# Altium schematic sheet updatedLoraXbee.SchDoc: Micro_controller_LoRa
size A4; Organization: Controlytics.ai; Address4: Micro_controller; SheetNumber: 2; SheetTotal: 2
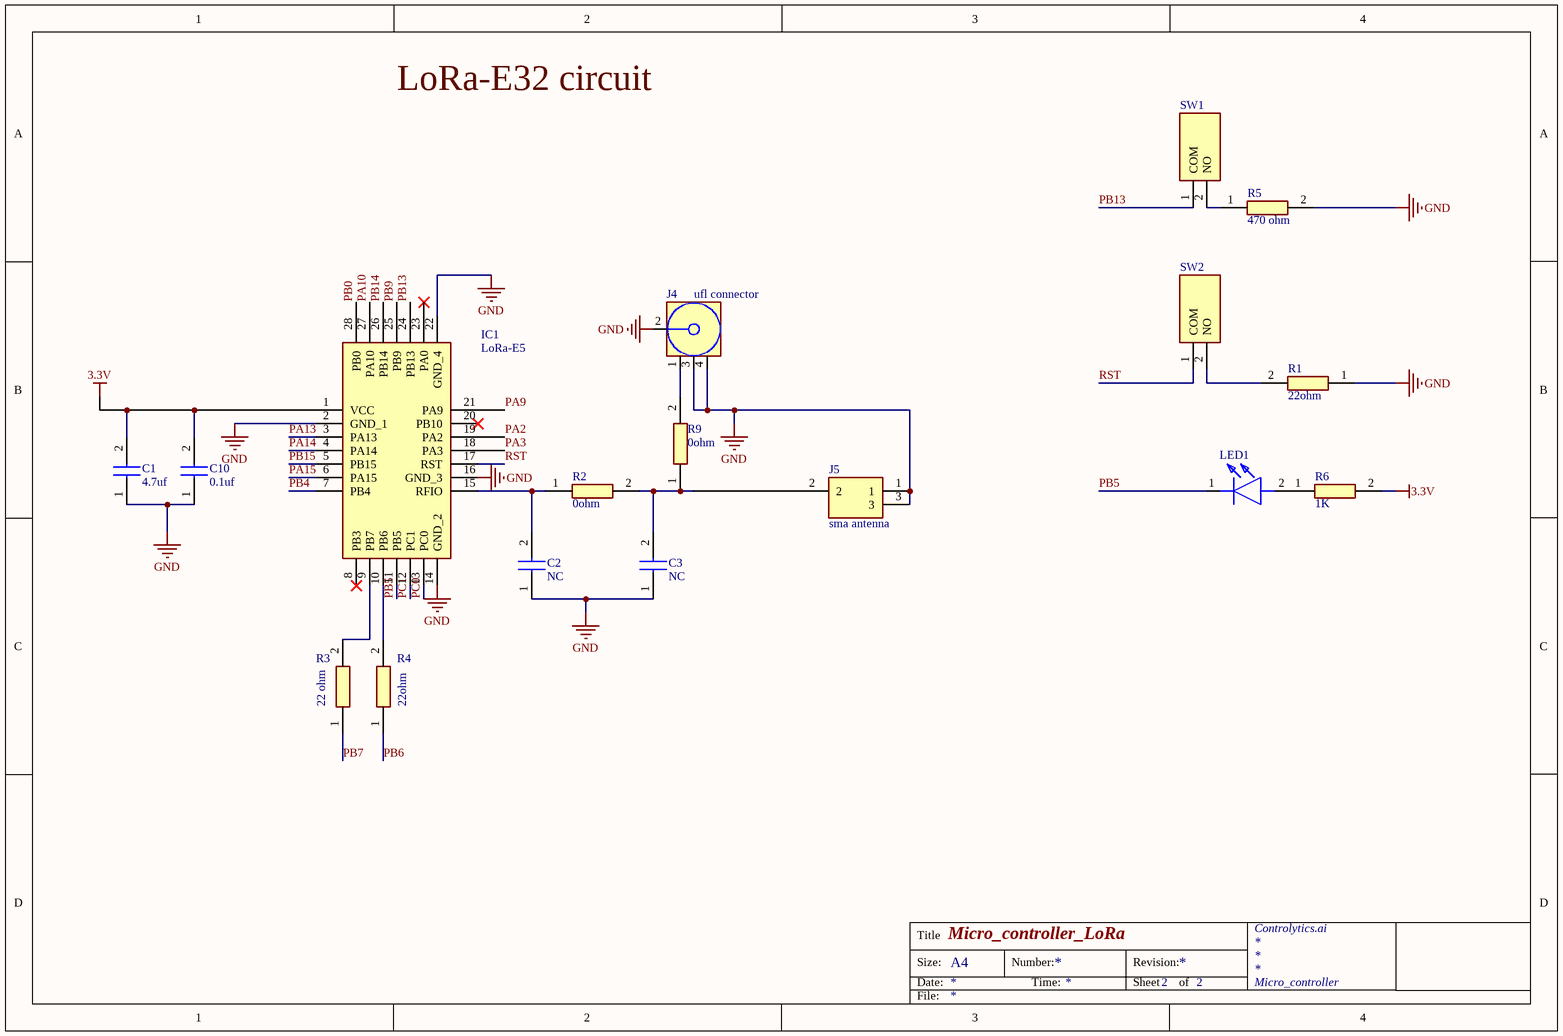
[diagram p0: updatedLoraXbee.SchDoc]

## Parts
C1  4.7uf  [CAPC1608X100N]
C2  NC  [CAPC1608X90N]
C3  NC  [CAPC1608X90N]
C10  0.1uf  [CAPC1608X100N]
IC1  LoRa-E5  [LoRaE5]
J4  ufl connector  [SMA_EDGE_5_6.4x7.8]
J5  sma antenna  [1909763-1]
LED1  FKR1111C-TR  [LED-0603-BLUE]  (value not drawn)
R1  22ohm  [RESC1609X55N]
R2  0ohm  [RESC1608X55N]
R3  22 ohm  [RESC1609X55N]
R4  22ohm  [RESC1609X55N]
R5  470 ohm  [RESC1608X55N]
R6  1K  [ERA3AEB101V]
R9  0ohm  [RESC1608X55N]
SW1  PTS636_SK25F_SMTR_LFS  [PTS636SK25FSMTRLFS]  (value not drawn)
SW2  PTS636_SK25F_SMTR_LFS  [PTS636SK25FSMTRLFS]  (value not drawn)

## Nets
3.3V: C1.2 C10.2 IC1.1(VCC) R6.2
GND: C1.1 C2.1 C3.1 C10.1 IC1.2(GND_1) IC1.14(GND_2) IC1.16(GND_3) IC1.22(GND_4) J4.2(Signal) J4.3(GND) J4.4(GND) J5.1 J5.3 R1.1 R5.2
PA2: IC1.19(PA2)
PA3: IC1.18(PA3)
PA9: IC1.21(PA9)
PA10: IC1.27(PA10)
PA13: IC1.3(PA13)
PA14: IC1.4(PA14)
PA15: IC1.6(PA15)
PB0: IC1.28(PB0)
PB4: IC1.7(PB4)
PB5: IC1.11(PB5) LED1.1(K)
PB6: R4.1
PB7: R3.1
PB9: IC1.25(PB9)
PB13: IC1.24(PB13) SW1.1(COM)
PB14: IC1.26(PB14)
PB15: IC1.5(PB15)
PC0: IC1.13(PC0)
PC1: IC1.12(PC1)
RST: IC1.17(RST) SW2.1(COM)
NetC2_2: C2.2 IC1.15(RFIO) R2.1
NetC3_2: C3.2 J5.2 R2.2 R9.1
NetIC1_9: IC1.9(PB7) R3.2
NetIC1_10: IC1.10(PB6) R4.2
NetJ4_1: J4.1(GND) R9.2
NetLED1_2: LED1.2(A) R6.1
NetR1_2: R1.2 SW2.2(NO)
NetR5_1: R5.1 SW1.2(NO)

Not connected (* = marked no-connect by the designer): IC1 8(PB3)* 20(PB10)* 23(PA0)*

## Notes on the sheet
- LoRa-E32 circuit
- Title
- Size:
- Date:
- A4
- Number:
- Time:
- Revision:
- Sheet
- of
- File:

## Library data of the parts
C1 C10 = GCJ188C70J475KE02D: Capacitor; Manufacturer_Name: Murata Electronics; Datasheet Link: https://psearch.en.murata.com/capacitor/product/GCJ188C70J475KE02%23.html; Height: 1mm; Manufacturer_Part_Number: GCJ188C70J475KE02D; Mouser Part Number: 81-GCJ188C70J475KE2D; Mouser Price/Stock: https://www.mouser.co.uk/ProductDetail/Murata-Electronics/GCJ188C70J475KE02D?qs=QzBtWTOodeVfJR8CElrI4A%3D%3D; Arrow Part Number: GCJ188C70J475KE02D; Arrow Price/Stock: https://www.arrow.com/en/products/gcj188c70j475ke02d/murata-manufacturing?region=nac
C2 C3 = GRM188R71C104MA01D: Capacitor; Manufacturer_Name: Murata Electronics; Datasheet Link: http://componentsearchengine.com/Datasheets/1/GRM188R71C104MA01D.pdf; Height: 0.9mm; Manufacturer_Part_Number: GRM188R71C104MA01D; Mouser Part Number: 81-GRM18R71C104MA01D; Mouser Price/Stock: https://www.mouser.com/Search/Refine.aspx?Keyword=81-GRM18R71C104MA01D; Arrow Part Number: GRM188R71C104MA01D; Arrow Price/Stock: https://www.arrow.com/en/products/grm188r71c104ma01d/murata-manufacturing
IC1 = LoRa-E5: Integrated Circuit; Manufacturer_Name: Seeed Studio; Datasheet Link: https://no.mouser.com/datasheet/2/744/LoRa_E5_module_datasheet_V1_0-2488126.pdf; Height: 2.5mm; Manufacturer_Part_Number: LoRa-E5
J4 = SMA_CON_4: ComponentLink1URL: http://www.amphenolrf.com/media/downloads/3672/132372-11.pdf; ComponentLink1Description: http://www.amphenolrf.com/media/downloads/3672/132372-11.pdf
J5 = 1909763-1: Connector; Manufacturer_Name: TE Connectivity; Datasheet Link: http://www.te.com/commerce/DocumentDelivery/DDEController?Action=srchrtrv&DocNm=1909763&DocType=Customer+Drawing&DocLang=English; Manufacturer_Part_Number: 1909763-1; Mouser Part Number: 571-1909763-1; Mouser Price/Stock: https://www.mouser.co.uk/ProductDetail/TE-Connectivity-AMP/1909763-1?qs=zR8VgEwoOb2%252BUqFkM9%2F6jQ%3D%3D; Arrow Part Number: 1909763-1; Arrow Price/Stock: https://www.arrow.com/en/products/1909763-1/te-connectivity?region=nac
LED1 = FKR1111C-TR: LED; Manufacturer_Name: Stanley Electric; Datasheet Link: http://www.stanley-components.com/php/downloaddatafile.php?rp=0,FKR1111C-TR_e.pdf; Height: 0.8mm; Manufacturer_Part_Number: FKR1111C-TR; Mouser Part Number: 327-FKR1111CTR; Mouser Price/Stock: https://www.mouser.co.uk/ProductDetail/Stanley-Electric/FKR1111C-TR?qs=byeeYqUIh0N4LNttpqKOoA%3D%3D; Arrow Part Number: FKR1111C-TR; Arrow Price/Stock: https://www.arrow.com/en/products/fkr1111c-tr/stanley-electric?region=nac
R1 R3 R4 = ERJ-P03J220V: Resistor; Manufacturer_Name: Panasonic; Datasheet Link: http://industrial.panasonic.com/cdbs/www-data/pdf/RDA0000/AOA0000C102.pdf; Height: 0.55mm; Manufacturer_Part_Number: ERJ-P03J220V; Mouser Part Number: 667-ERJ-P03J220V; Mouser Price/Stock: https://www.mouser.co.uk/ProductDetail/Panasonic/ERJ-P03J220V?qs=18kBAoNi3c8s2FjgUUqr2Q%3D%3D
R2 R9 = MCT0603HZ0000ZP500: Resistor; Manufacturer_Name: Vishay; Datasheet Link: http://www.vishay.com/docs/28705/mcx0x0xpro.pdf; Height: 0.55mm; Manufacturer_Part_Number: MCT0603HZ0000ZP500; Mouser Part Number: 594-MCT0603HZ0000ZP5; Mouser Price/Stock: https://www.mouser.co.uk/ProductDetail/Vishay-Beyschlag/MCT0603HZ0000ZP500?qs=xy8ZAJ6gwchPwuxyJv%252BYaw%3D%3D; Arrow Part Number: MCT0603HZ0000ZP500; Arrow Price/Stock: https://www.arrow.com/en/products/mct0603hz0000zp500/vishay?region=nac
R5 = ERJ-S03F4700V: Resistor; Manufacturer_Name: Panasonic; Datasheet Link: https://industrial.panasonic.com/cdbs/www-data/pdf/RDP0000/AOA0000C334.pdf; Height: 0.55mm; Manufacturer_Part_Number: ERJ-S03F4700V; Mouser Part Number: 667-ERJ-S03F4700V; Mouser Price/Stock: https://www.mouser.co.uk/ProductDetail/Panasonic/ERJ-S03F4700V?qs=Zyl8A9hlmJo8QyiDzgvbZA%3D%3D
R6 = ERA-3AED102V: Resistor; Manufacturer_Name: Panasonic; Datasheet Link: https://industrial.panasonic.com/cdbs/www-data/pdf/RDM0000/AOA0000C307.pdf; Height: 0.55mm; Manufacturer_Part_Number: ERA-3AED102V; Mouser Part Number: 667-ERA-3AED102V; Mouser Price/Stock: https://www.mouser.co.uk/ProductDetail/Panasonic/ERA-3AED102V?qs=yocZuyCaXdNrh6oeFjCchg%3D%3D; Arrow Part Number: ERA-3AED102V; Arrow Price/Stock: https://www.arrow.com/en/products/era3aed102v/panasonic?region=nac
SW1 SW2 = SW1_PTS636_SK25F_SMTR_LFS-SMT: Switch; Manufacturer_Name: C & K COMPONENTS; Manufacturer_Part_Number: PTS636 SK25F SMTR LFS; Datasheet Link: https://www.mouser.com/datasheet/2/60/pts636-1550567.pdf; Height: 2.7mm; Mouser Part Number: 611-PTS636SK25FSMTRL; Mouser Price/Stock: https://www.mouser.co.uk/ProductDetail/CK/PTS636-SK25F-SMTR-LFS?qs=vLWxofP3U2zO9PvdsA2GhQ%3D%3D; Arrow Part Number: PTS636 SK25F SMTR LFS; Arrow Price/Stock: https://www.arrow.com/en/products/pts636-sk25f-smtr-lfs/ck